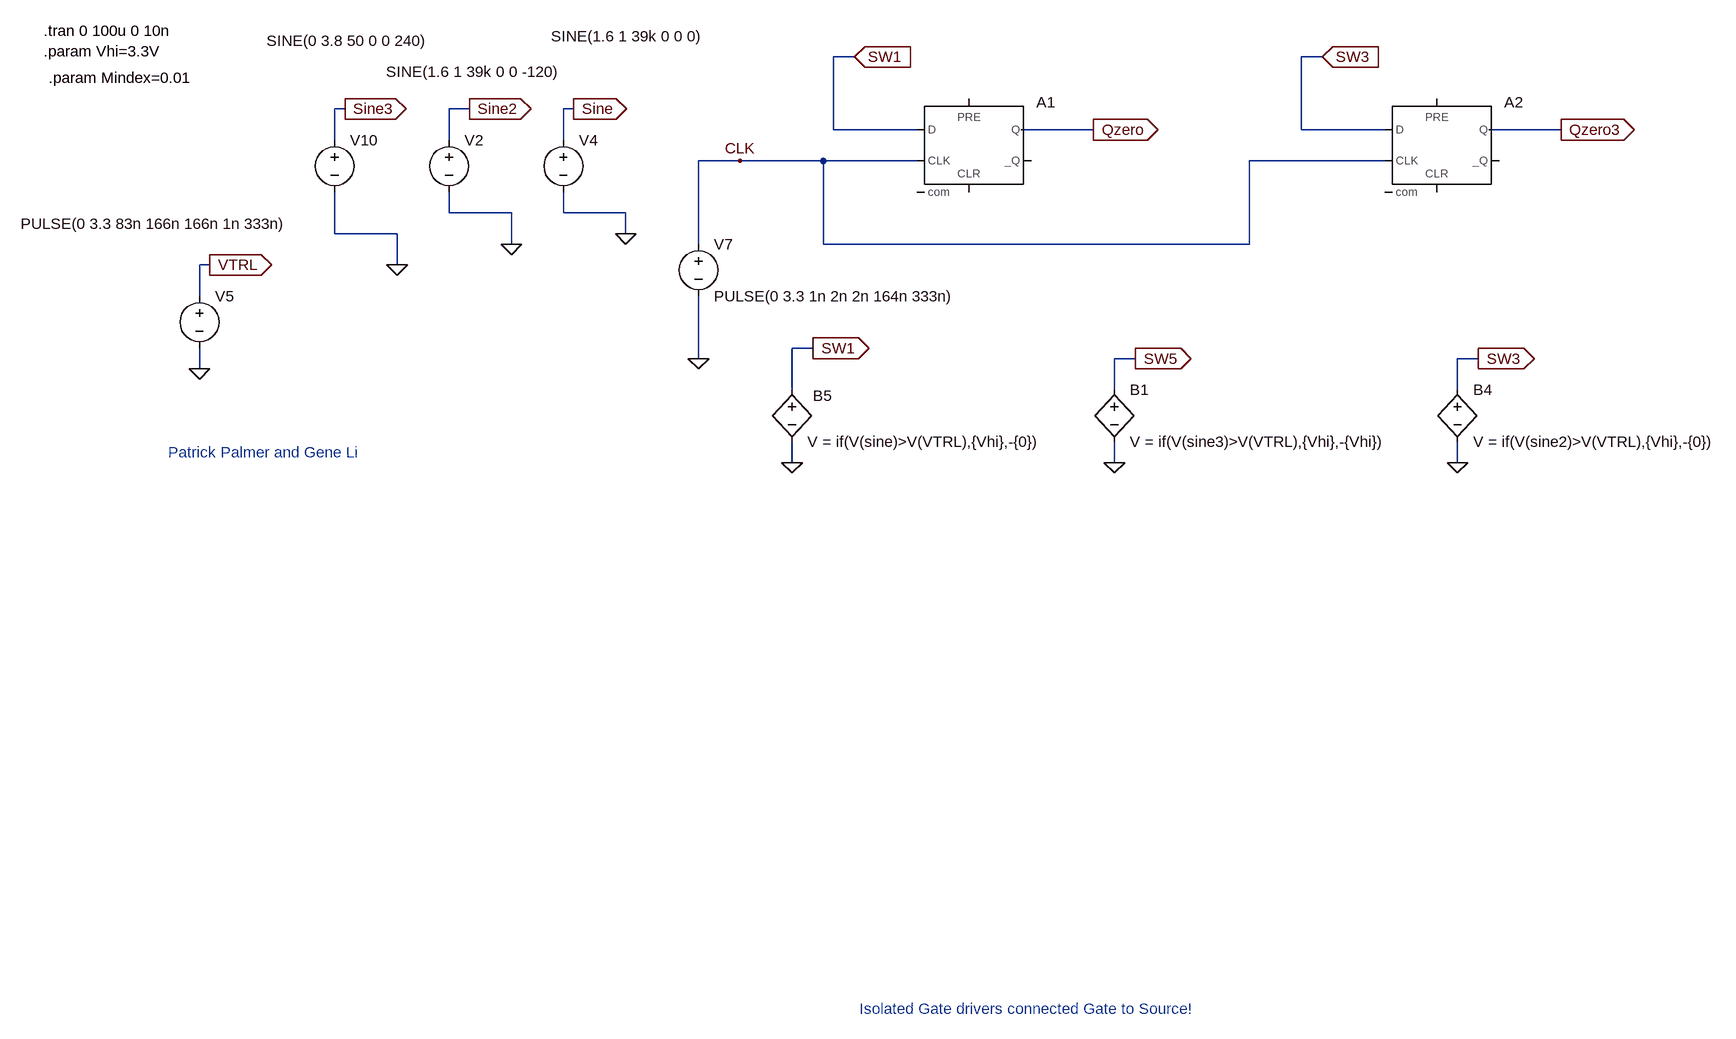
[diagram p0: schematic PDM_V1.asc]
PDM_V1.asc, the LTspice schematic file:
Version 4
SHEET 1 2140 1812
WIRE 144 -112 112 -112
WIRE 864 -112 832 -112
WIRE -640 -32 -656 -32
WIRE -448 -32 -480 -32
WIRE -288 -32 -304 -32
WIRE 112 0 112 -112
WIRE 240 0 112 0
WIRE 512 0 400 0
WIRE 832 0 832 -112
WIRE 960 0 832 0
WIRE 1232 0 1120 0
WIRE -656 16 -656 -32
WIRE -480 16 -480 -32
WIRE -304 16 -304 -32
WIRE -32 48 -96 48
WIRE 96 48 -32 48
WIRE 240 48 96 48
WIRE 960 48 752 48
WIRE -480 128 -480 96
WIRE -384 128 -480 128
WIRE -304 128 -304 96
WIRE -208 128 -304 128
WIRE -656 160 -656 96
WIRE -560 160 -656 160
WIRE -208 160 -208 128
WIRE -384 176 -384 128
WIRE -96 176 -96 48
WIRE 96 176 96 48
WIRE 752 176 752 48
WIRE 752 176 96 176
WIRE -848 208 -864 208
WIRE -560 208 -560 160
WIRE -864 256 -864 208
WIRE 80 336 48 336
WIRE -96 352 -96 256
WIRE 576 352 544 352
WIRE 1104 352 1072 352
WIRE -864 368 -864 336
WIRE 48 400 48 336
WIRE 544 400 544 352
WIRE 1072 400 1072 352
WIRE 48 512 48 480
WIRE 544 512 544 480
WIRE 1072 512 1072 480
FLAG -848 208 VTRL
IOPIN -848 208 Out
FLAG 80 336 SW1
IOPIN 80 336 Out
FLAG 1104 352 SW3
IOPIN 1104 352 Out
FLAG -288 -32 Sine
IOPIN -288 -32 Out
FLAG -864 368 0
FLAG -208 160 0
FLAG -96 352 0
FLAG -448 -32 Sine2
IOPIN -448 -32 Out
FLAG 576 352 SW5
IOPIN 576 352 Out
FLAG -640 -32 Sine3
IOPIN -640 -32 Out
FLAG -384 176 0
FLAG -560 208 0
FLAG 48 512 0
FLAG 1072 512 0
FLAG 544 512 0
FLAG -32 48 CLK
FLAG 144 -112 SW1
IOPIN 144 -112 In
FLAG 512 0 Qzero
IOPIN 512 0 Out
FLAG 864 -112 SW3
IOPIN 864 -112 In
FLAG 1232 0 Qzero3
IOPIN 1232 0 Out
SYMBOL voltage -304 0 R0
WINDOW 123 0 0 Left 0
WINDOW 39 0 0 Left 0
WINDOW 3 -19 -144 Left 2
SYMATTR Value SINE(1.6 1 39k 0 0 0)
SYMATTR InstName V4
SYMBOL voltage -864 240 R0
WINDOW 123 0 0 Left 0
WINDOW 39 0 0 Left 0
WINDOW 3 -275 -95 Left 2
SYMATTR Value PULSE(0 3.3 83n 166n 166n 1n 333n)
SYMATTR InstName V5
SYMBOL bv 1072 384 R0
SYMATTR InstName B4
SYMATTR Value V = if(V(sine2)>V(VTRL),{Vhi},-{0})
SYMBOL bv 48 384 R0
WINDOW 0 32 25 Left 2
SYMATTR InstName B5
SYMATTR Value V = if(V(sine)>V(VTRL),{Vhi},-{0})
SYMBOL voltage -480 0 R0
WINDOW 123 0 0 Left 0
WINDOW 39 0 0 Left 0
WINDOW 3 -97 -89 Left 2
SYMATTR Value SINE(1.6 1 39k 0 0 -120)
SYMATTR InstName V2
SYMBOL bv 544 384 R0
SYMATTR InstName B1
SYMATTR Value V = if(V(sine3)>V(VTRL),{Vhi},-{Vhi})
SYMBOL voltage -656 0 R0
WINDOW 123 0 0 Left 0
WINDOW 39 0 0 Left 0
WINDOW 3 -105 -137 Left 2
SYMATTR Value SINE(0 3.8 50 0 0 240)
SYMATTR InstName V10
SYMBOL voltage -96 160 R0
WINDOW 123 0 0 Left 0
WINDOW 39 0 0 Left 0
SYMATTR InstName V7
SYMATTR Value PULSE(0 3.3 1n 2n 2n 164n 333n)
SYMBOL Digital\\dflop 320 -48 R0
SYMATTR InstName A1
SYMBOL Digital\\dflop 1040 -48 R0
SYMATTR InstName A2
TEXT -1104 -152 Left 2 !.tran 0 100u 0 10n\n.param Vhi=3.3V
TEXT 152 1352 Left 2 ;Isolated Gate drivers connected Gate to Source!
TEXT -1096 -80 Left 2 !.param Mindex=0.01
TEXT -912 496 Left 2 ;Patrick Palmer and Gene Li

The netlist it stands for:
* PDM_V1.asc
V4 Sine 0 SINE(1.6 1 39k 0 0 0)
V5 VTRL 0 PULSE(0 3.3 83n 166n 166n 1n 333n)
B4 SW3 0 V = if(V(sine2)>V(VTRL),{Vhi},-{0})
B5 SW1 0 V = if(V(sine)>V(VTRL),{Vhi},-{0})
V2 Sine2 0 SINE(1.6 1 39k 0 0 -120)
B1 SW5 0 V = if(V(sine3)>V(VTRL),{Vhi},-{Vhi})
V10 Sine3 0 SINE(0 3.8 50 0 0 240)
V7 CLK 0 PULSE(0 3.3 1n 2n 2n 164n 333n)
A1 SW1 0 CLK 0 0 0 Qzero 0 DFLOP
A2 SW3 0 CLK 0 0 0 Qzero3 0 DFLOP
.tran 0 100u 0 10n
.param Vhi=3.3V
* Isolated Gate drivers connected Gate to Source!
.param Mindex=0.01
* Patrick Palmer and Gene Li
.backanno
.end

* Results of the author's LTspice run, read from the files saved beside the schematic
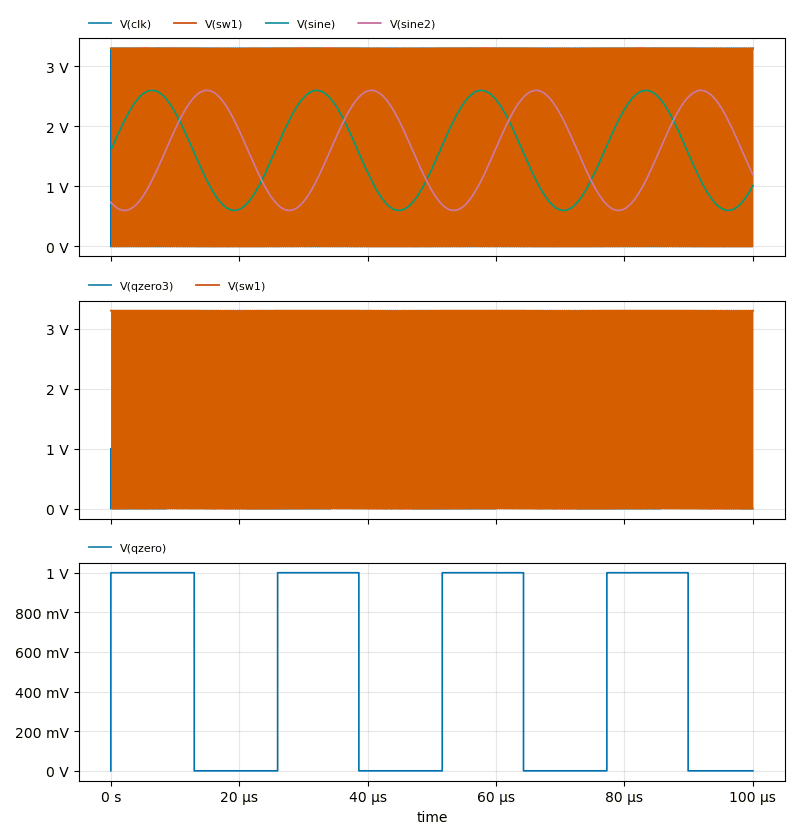
[diagram p1: Transient Analysis of PDM_V1.asc, plotted from the saved traces]
* Transient Analysis, 1 run:
*   V(clk): min 0 V, max 3.3 V, average 1.647 V, rms 2.331 V, last 3.3 V
*   V(sw1): min 0 V, max 3.3 V, average 1.611 V, rms 2.306 V, last 3.3 V
*   V(sine): min 600 mV, max 2.6 V, average 1.608 V, rms 1.759 V, last 1.012 V
*   V(sine2): min 600 mV, max 2.6 V, average 1.617 V, rms 1.765 V, last 1.193 V
*   V(qzero3): min 0 V, max 1 V, average 509.5 mV, rms 713.8 mV, last 0 V
*   V(sw1): min 0 V, max 3.3 V, average 1.611 V, rms 2.306 V, last 3.3 V
*   V(qzero): min 0 V, max 1 V, average 509.5 mV, rms 713.8 mV, last 0 V